# EAGLE design V2 (EAGLE 9.6.2)
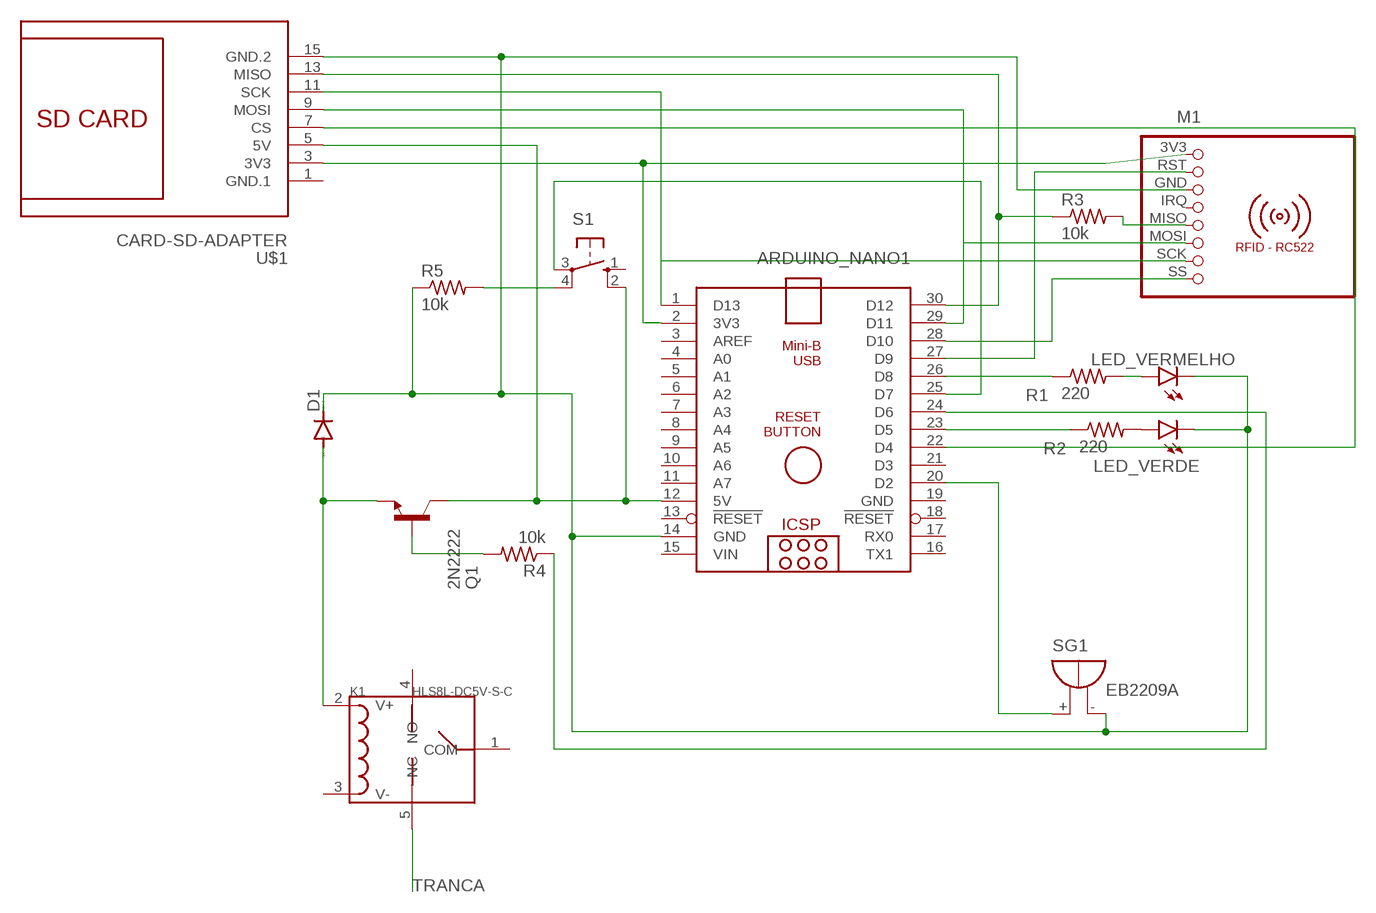
[diagram p0: schematic, sheet 1]

## Parts
ARDUINO_NANO1  ARDUINO_NANO  [ARDUINO_NANO]
D1  1N4148DO35-10  [DO35-10]
K1  HLS8L-DC5V-S-C  RELAY-HLS8L-DC5V-S-C(5P-19X15MM)  [REY5-19.0X15.0X15.0MM]
LED_VERDE  -LED  [LED5]
LED_VERMELHO  -LED  [LED5]
M1  RFID-RC522  [RFID-RC522]
Q1  2N2222  [TO92-CBE]
R1  220  R-US_0204/5  [0204/5]
R2  220  R-US_0204/5  [0204/5]
R3  10k  R-US_0204/5  [0204/5]
R4  10k  R-US_0204/5  [0204/5]
R5  10k  R-US_0204/5  [0204/5]
S1  10-XX  [B3F-10XX]
SG1  EB2209A  [EB2209A]
U$1  CARD-SD-ADAPTER  [CARD-SD-ADAPTER]

## Nets
N$1: ARDUINO_NANO1.20(D2) SG1.+
N$2: LED_VERMELHO.ANODE R1.2
N$3: LED_VERDE.ANODE R2.2
N$4: ARDUINO_NANO1.26(D8) R1.1
N$5: ARDUINO_NANO1.23(D5) R2.1
N$6: ARDUINO_NANO1.24(D6) R4.1
N$7: D1.A K1.2(V+) Q1.E
N$8: Q1.B R4.2
N$9: ARDUINO_NANO1.14(GND) D1.C LED_VERDE.CATHODE LED_VERMELHO.CATHODE M1.GND R5.1 SG1.- U$1.15(GND.2)
N$10: ARDUINO_NANO1.12(5V) Q1.C S1.2(S1) U$1.5(5V)
N$11: ARDUINO_NANO1.25(D7) S1.3(P)
N$12: ARDUINO_NANO1.2(3V3) M1.3V3 U$1.3(3V3)
N$13: R5.2 S1.4(P1)
N$14: ARDUINO_NANO1.27(D9) M1.RST
N$15: M1.MISO R3.2
N$16: ARDUINO_NANO1.30(D12) R3.1 U$1.13(MISO)
N$17: ARDUINO_NANO1.29(D11) M1.MOSI U$1.9(MOSI)
N$18: ARDUINO_NANO1.22(D4) U$1.7(CS)
N$19: ARDUINO_NANO1.28(D10) M1.SS
N$20: ARDUINO_NANO1.1(D13) M1.SCK U$1.11(SCK)
TRANCA: K1.5(NC)
Unconnected: ARDUINO_NANO1.3(AREF) ARDUINO_NANO1.4(A0) ARDUINO_NANO1.5(A1) ARDUINO_NANO1.6(A2) ARDUINO_NANO1.7(A3) ARDUINO_NANO1.8(A4) ARDUINO_NANO1.9(A5) ARDUINO_NANO1.10(A6) ARDUINO_NANO1.11(A7) ARDUINO_NANO1.13(!RESET) ARDUINO_NANO1.16(TX1) ARDUINO_NANO1.17(RX0) ARDUINO_NANO1.18(!RESET) ARDUINO_NANO1.21(D3) K1.1(COM) K1.3(V-) K1.4(NO) M1.IRQ S1.1(S)

## Power pins joined to a net without a drawn wire
GND: ARDUINO_NANO1.19(GND)
GND.1: U$1.1(GND.1)
VIN: ARDUINO_NANO1.15(VIN)

## Library data of the parts
ARDUINO_NANO1 = ArduinoNanoV30:ARDUINO_NANO: Arduino Nano V3.0 Overview: The Arduino Nano is a small, complete, and breadboard-friendly board based on the ATmega328 (Arduino Nano 3.x) or ATmega168 (Arduino Nano 2.x). It has more or less the same functionality of the Arduino Duemilanove, but in a different package. It lacks only a DC power jack, and works with a Mini-B USB cable instead of a standard one. The Nano was designed and is being produced by Gravitech. Specifications: Microcontroller Atmel ATmega168 or ATmega328 Operating Voltage (logic level) 5 V Input Voltage (recommended) 7-12 V Input Voltage (limits) 6-20 V Digital I/O Pins 14 (of which 6 provide PWM output) Analog Input Pins 8 DC Current per I/O Pin 40 mA Flash Memory 16 KB (ATmega168) or 32 KB (ATmega328) of which 2 KB used by bootloader SRAM 1 KB (ATmega168) or 2 KB (ATmega328) EEPROM 512 bytes (ATmega168) or 1 KB (ATmega328) Clock Speed 16 MHz Dimensions 0.73" x 1.70" Length 45 mm Width 18 mm Weigth 5 g Power: The Arduino Nano can be powered via the Mini-B USB connection, 6-20V unregulated external power supply (pin 30), or 5V regulated external power supply (pin 27). The power source is automatically selected to the highest voltage source. Memory: The ATmega168 has 16 KB of flash memory for storing code (of which 2 KB is used for the bootloader); the ATmega328 has 32 KB, (also with 2 KB used for the bootloader). The ATmega168 has 1 KB of SRAM and 512 bytes of EEPROM (which can be read and written with the EEPROM library); the ATmega328 has 2 KB of SRAM and 1 KB of EEPROM. Input and Output: Each of the 14 digital pins on the Nano can be used as an input or output, using pinMode(), digitalWrite(), and digitalRead() functions. They operate at 5 volts. Each pin can provide or receive a maximum of 40 mA and has an internal pull-up resistor (disconnected by default) of 20-50 kOhms. In addition, some pins have specialized functions. Visit Arduino - ArduinoBoardNano <https://www.arduino.cc/en/Main/ArduinoBoardNano>
D1 = diode:1N4148: DIODE high speed (Philips)
K1 = nosso_relay:RELAY-HLS8L-DC5V-S-C(5P-19X15MM): 315030000; MPN: HLS8L-DC5V-S-C
LED_VERDE LED_VERMELHO = LED_library:-LED
M1 = MFRC522:RFID-RC522: RFID-RC522 MFRC-522 based breakout board
Q1 = RFID Reader Part Library:2N2222*: NPN Transistor
R1-R5 = rcl:R-US_: RESISTOR, American symbol; SPICEPREFIX: R
S1 = switch-omron:10-XX: OMRON SWITCH; MPN: B3F-1000; OC_FARNELL: 176432; OC_NEWARK: 36M3542
SG1 = buzzer:EB2209A: BUZZER Source: Buerklin; OC_FARNELL: unknown; OC_NEWARK: unknown
U$1 = diy-modules:CARD-SD-ADAPTER: Full Size SD Card Adapter Module with onboard 3.3V regulator Guide describing how to use SD card with Arduino is available here: https://www.arduino.cc/en/Reference/SDCardNotes Click here to find device on ebay.com <http://www.ebay.com/sch/sd+card+socket+module>

## Net classes
0 default: width 0.508 mm
1 Alimentacao: width 1.016 mm

## Board
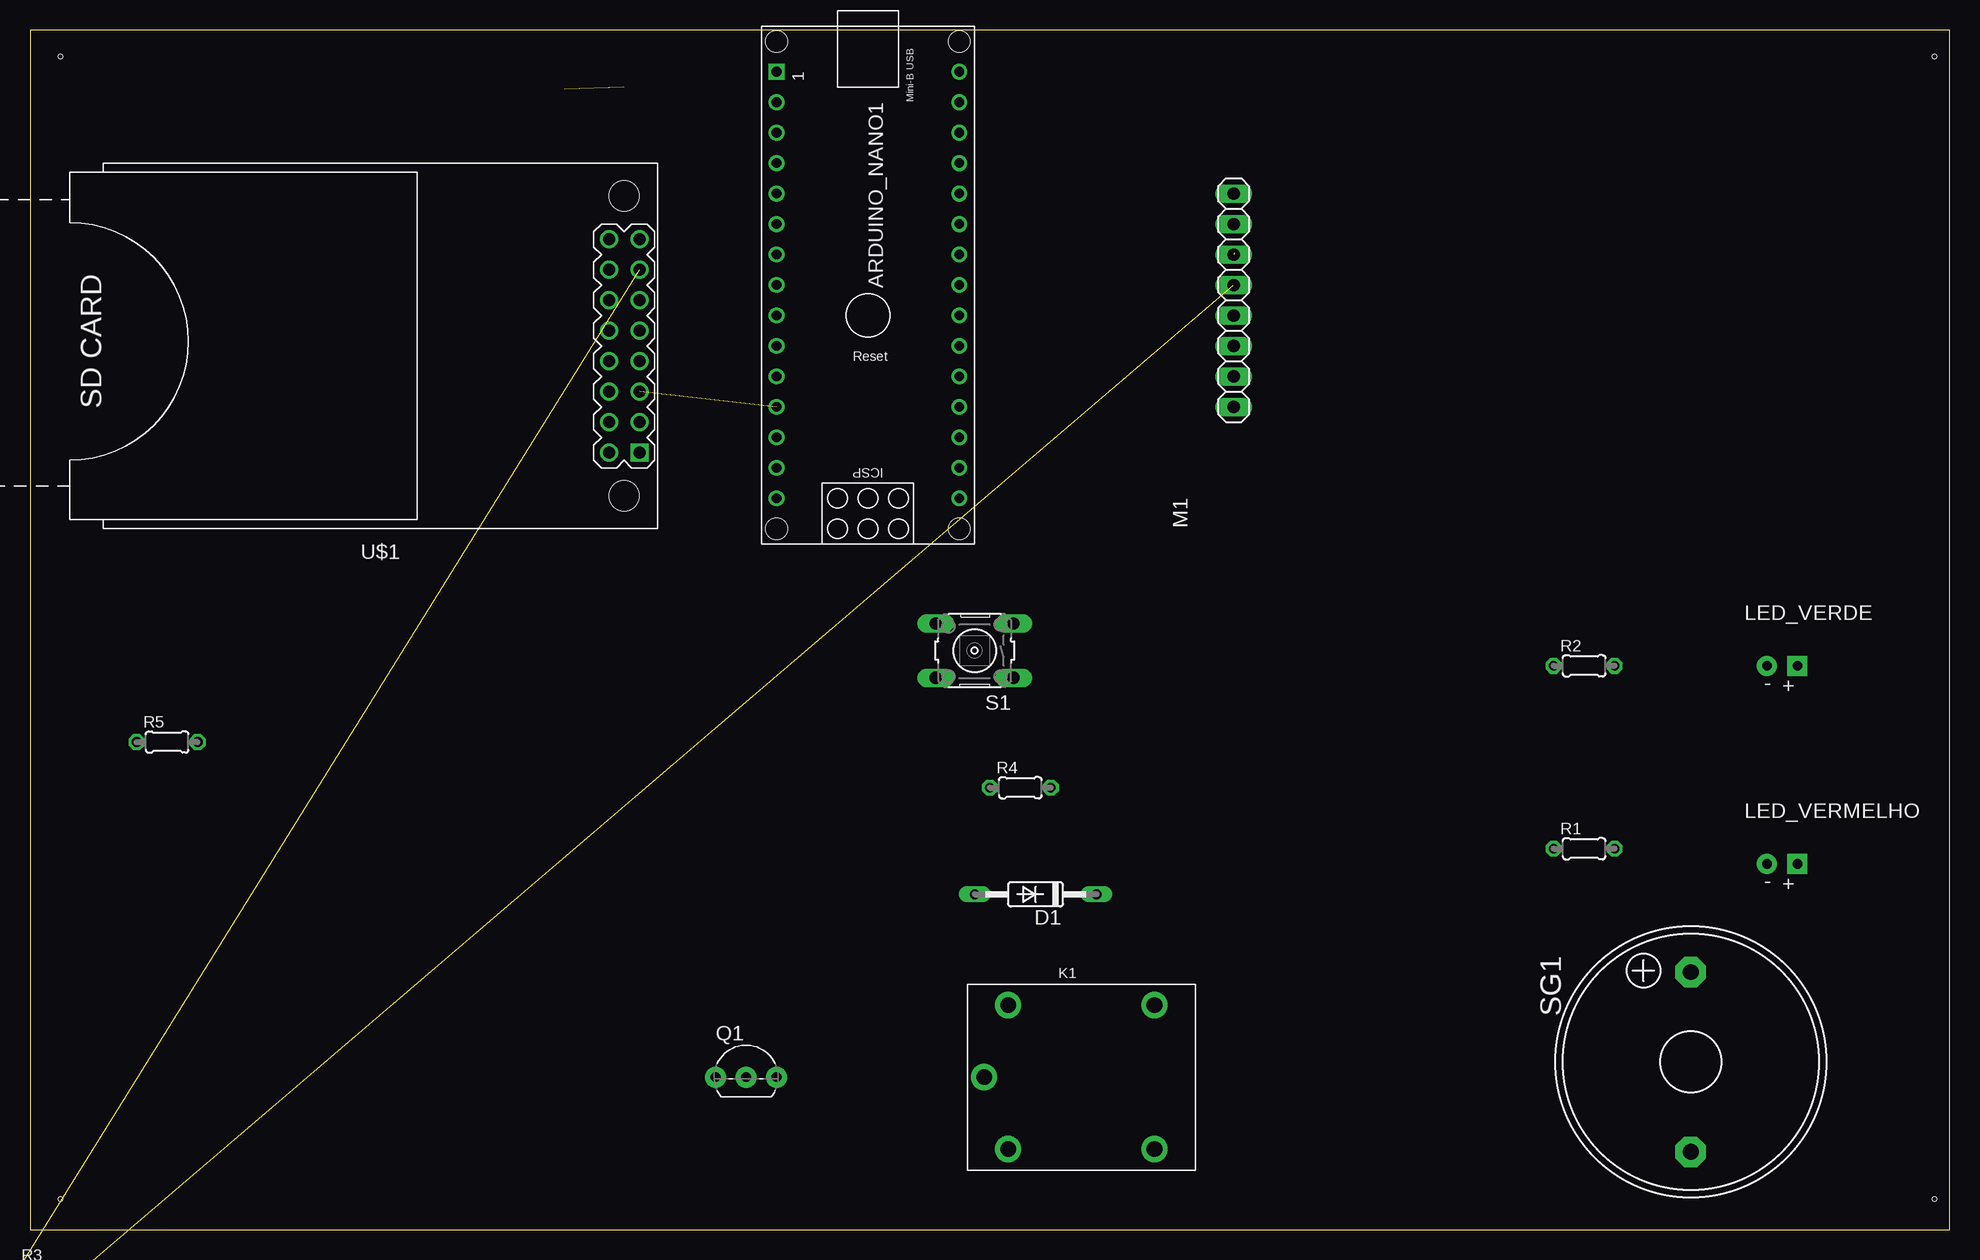
[diagram p1: board, top side]
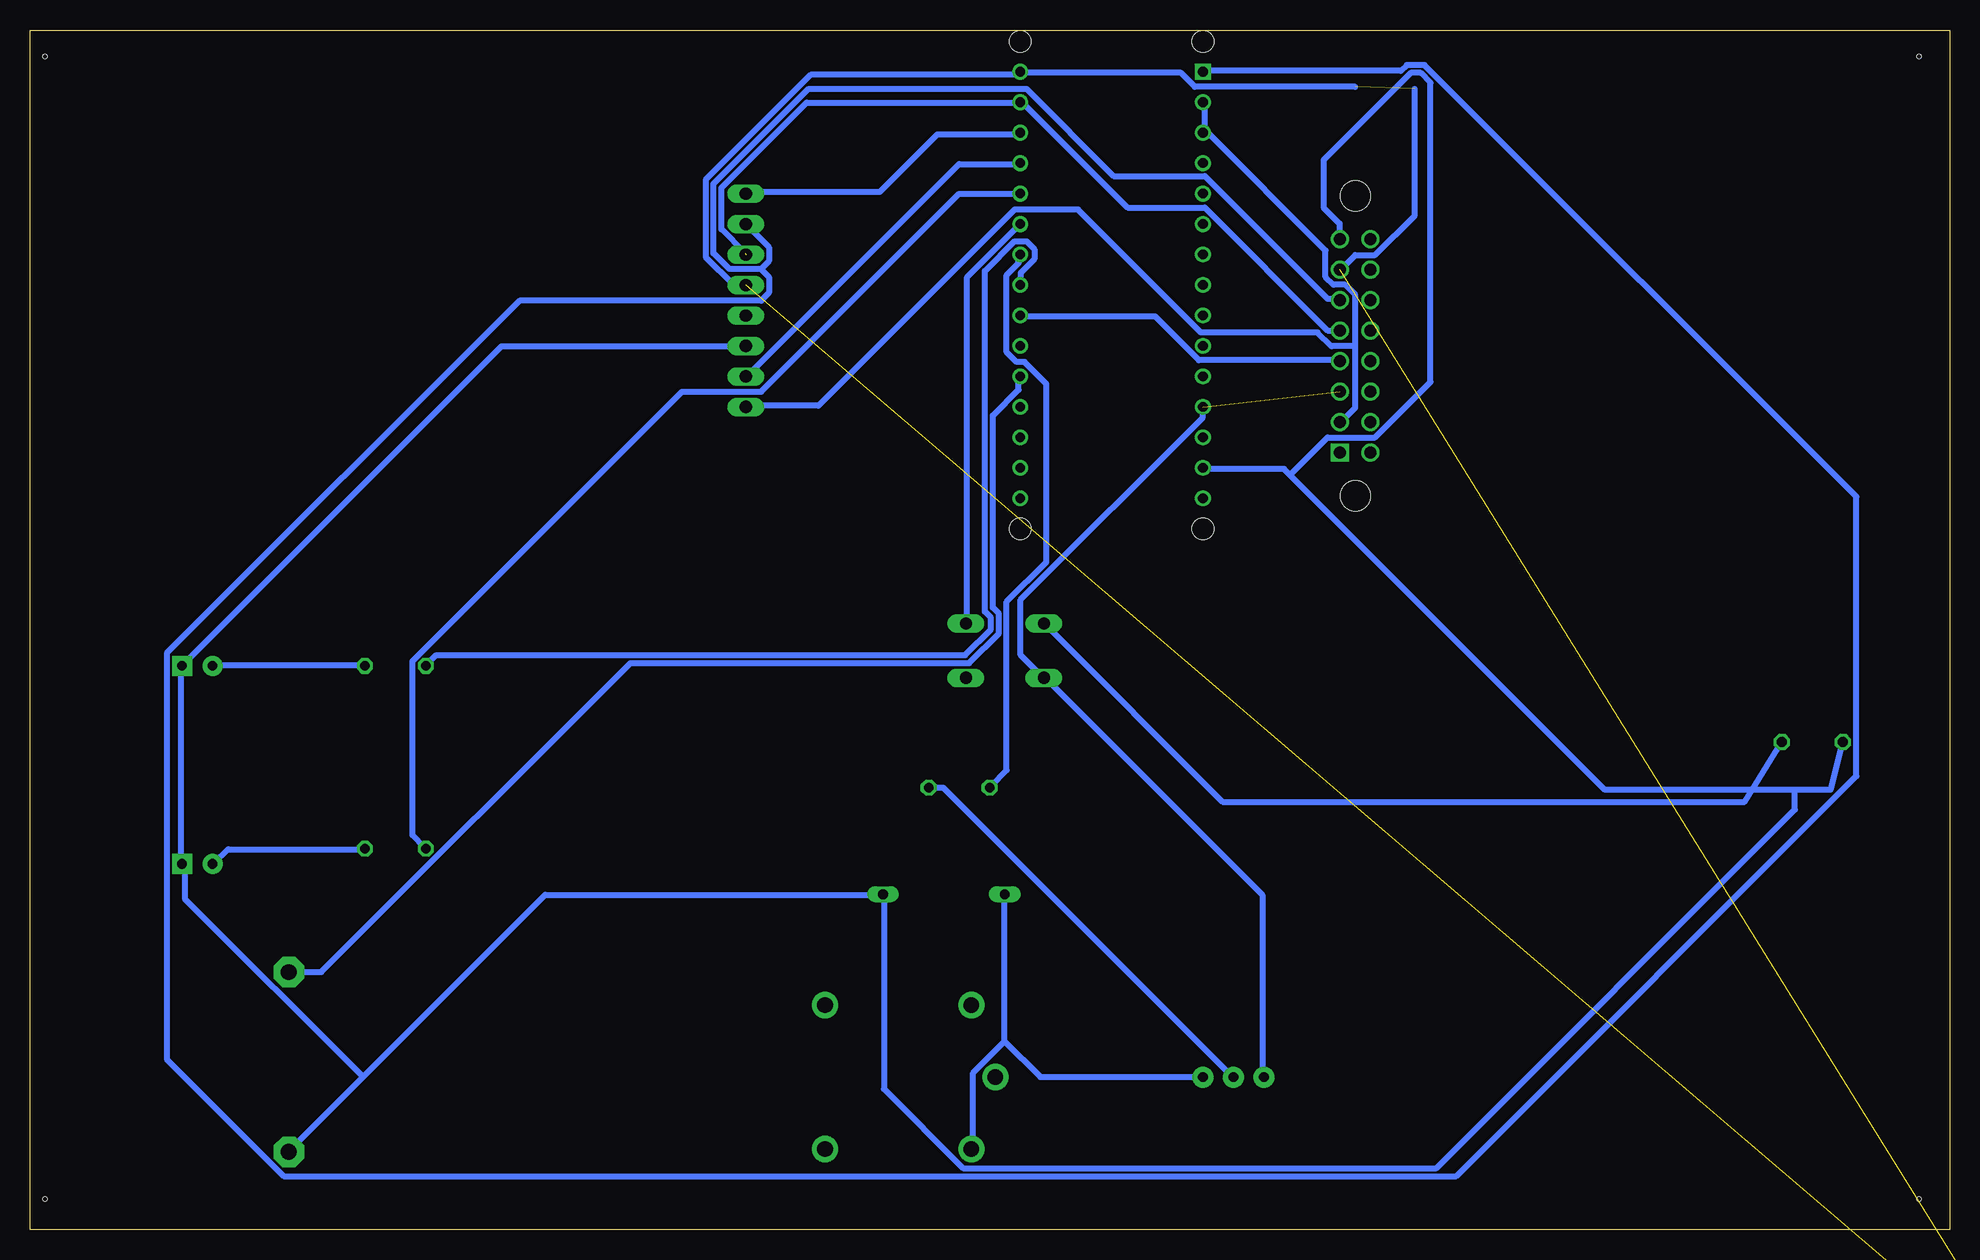
[diagram p2: board, bottom side, seen from below]

Size 160 x 100 mm. Coordinates in mm from the lower left corner, seen from the top.
Outline: 0,0 160,0 160,100 0,100 0,0
Copper layers (1*16): Top 0.035mm / dielectric 1.5mm / Bottom 0.035mm
Design rules "default": minimum track width 6mil, minimum drill 0.35mm, track to track 6mil, track to pad 6mil, pad to pad 6mil, via to via 6mil, smd to smd 6mil, copper to edge 40mil, drill to drill 6mil, minimum pad ring 10mil, minimum via ring 8mil, stop-mask expansion 4mil, vias tented up to drill 0mil, thermal gap 10mil
Holes 0.35 mm at 2.54,97.79 2.54,2.54 158.75,97.79 158.75,2.54

### Footprints (pad centres in the part's own frame; a part is rotated, then mirrored left to right if it is on the bottom)
ARDUINO_NANO = drill 0.8 square: 1 -20.32,-7.62 | drill 0.8: 2 -17.78,-7.62; 3 -15.24,-7.62; 4 -12.7,-7.62; 5 -10.16,-7.62; 6 -7.62,-7.62; 7 -5.08,-7.62; 8 -2.54,-7.62; 9 0,-7.62; 10 2.54,-7.62; 11 5.08,-7.62; 12 7.62,-7.62; 13 10.16,-7.62; 14 12.7,-7.62; 15 15.24,-7.62; 16 15.24,7.62; 17 12.7,7.62; 18 10.16,7.62; 19 7.62,7.62; 20 5.08,7.62; 21 2.54,7.62; 22 0,7.62; 23 -2.54,7.62; 24 -5.08,7.62; 25 -7.62,7.62; 26 -10.16,7.62; 27 -12.7,7.62; 28 -15.24,7.62; 29 -17.78,7.62; 30 -20.32,7.62 | hole 1.778: -22.86,-7.62; -22.86,7.62; 17.78,7.62; 17.78,-7.62
DO35-10 = drill 0.813 long: A 5.08,0; C -5.08,0
REY5-19.0X15.0X15.0MM = drill 1.3 pad 2.184: 1 -8.1,0; 2 -6.1,-6; 3 -6.1,6; 4 6.1,-6; 5 6.1,6
LED5 = drill 0.8 pad 1.676: ANODE -1.27,0 | drill 0.8 pad 1.676 square: CATHODE 1.27,0
RFID-RC522 = drill 1.016 long: 3V3 -8.89,0; GND -3.81,0; IRQ -1.27,0; MISO 1.27,0; MOSI 3.81,0; RST -6.35,0; SCK 6.35,0; SS 8.89,0
TO92-CBE = drill 0.813 pad 1.75: B 0,0; C -2.54,0; E 2.54,0
0204/5 = drill 0.813 octagon: 1 -2.54,0; 2 2.54,0
B3F-10XX = drill 1.016 long: 1 -3.251,2.261; 2 3.251,2.261; 3 -3.251,-2.261; 4 3.251,-2.261
EB2209A = drill 1.321 pad 2.54 octagon: + 7.493,0; - -7.493,0
CARD-SD-ADAPTER = drill 1 square: 1 -21.59,8.89 | drill 1: 2 -19.05,8.89; 3 -21.59,6.35; 4 -19.05,6.35; 5 -21.59,3.81; 6 -19.05,3.81; 7 -21.59,1.27; 8 -19.05,1.27; 9 -21.59,-1.27; 10 -19.05,-1.27; 11 -21.59,-3.81; 12 -19.05,-3.81; 13 -21.59,-6.35; 14 -19.05,-6.35; 15 -21.59,-8.89; 16 -19.05,-8.89 | hole 2.5: -20.32,12.5; -20.32,-12.5

### Placement (x,y rotation side)
ARDUINO_NANO1  69.85,76.2 270 top
D1  83.82,27.94 180 top
K1  87.63,12.7 0 top
LED_VERDE  146.05,46.99 0 top
LED_VERMELHO  146.05,30.48 0 top
M1  100.33,77.47 90 top
Q1  59.69,12.7 0 top
R1  129.54,31.75 0 top
R2  129.54,46.99 0 top
R3  1.27,-3.81 0 top  (outside the outline)
R4  82.55,36.83 0 top
R5  11.43,40.64 0 top
S1  78.74,48.26 180 top
SG1  138.43,13.97 90 top
U$1  29.21,73.66 180 top

### Tracks (layer width: path | path; a pad name or v marks a point on that pad's centre or on a via)
GND
  pour Bottom (isolate 1.27): 2.54,97.79 2.54,2.54 158.75,2.54 158.75,97.79
N$1
  Bottom 0.508: SG1.+ 135.71,21.46 109.96,47.22 81.72,47.22 79.25,49.7 79.25,51.35 79.74,51.84 79.74,67.86 77.6,70 77.6,70.99 ARDUINO_NANO1.20
N$2
  Bottom 0.508: R1.2 132.08,31.7 143.47,31.7 144.63,30.54 LED_VERMELHO.ANODE
N$3
  Bottom 0.508: R2.2 132.08,47.05 144.63,47.05 LED_VERDE.ANODE
N$4
  Bottom 0.508: ARDUINO_NANO1.26 77.6,86.35 82.55,86.35 99.06,69.84 105.66,69.84 128.12,47.38 128.12,32.85 127.13,31.86 R1.1
N$5
  Bottom 0.508: ARDUINO_NANO1.23 77.43,78.75 77.43,79.74 76.28,80.9 76.28,81.72 76.94,82.39 77.93,82.39 80.4,79.91 80.4,51.51 79.91,51.02 79.91,50.02 82.06,47.88 126.14,47.88 126.96,47.05 R2.1
N$6
  Bottom 0.508: ARDUINO_NANO1.24 77.6,81.23 77.6,80.57 78.59,79.58 78.59,73.14 77.76,72.31 77.1,72.31 75.29,70.5 75.29,55.64 78.59,52.34 78.59,38.3 79.91,36.98 R4.1
N$7
  Bottom 0.508: 78.75,15.68 78.75,27.9 D1.A | 78.75,15.68 81.39,13.04 81.39,6.77 K1.2 | 78.75,15.68 75.78,12.71 62.24,12.71 Q1.E
N$8
  Bottom 0.508: R4.2 85.03,36.82 83.87,36.82 59.77,12.71 Q1.B
N$9
  Bottom 0.508: 54.98,62.9 28.73,36.65 12.88,36.65 | 54.98,62.9 55.47,63.4 62.08,63.4 ARDUINO_NANO1.14 | 12.88,36.65 9.91,36.65 8.91,40.62 R5.1 | 54.98,62.9 51.84,66.04 47.88,66.04 43.26,70.66 43.26,95.59 44.08,96.42 44.91,96.42 52.17,89.15 52.17,85.19 50.85,83.87 50.85,82.55 U$1.15 | 132.25,12.71 138.35,6.6 SG1.- | 132.25,12.71 117.06,27.9 88.99,27.9 D1.C 88.82,27.74 88.82,11.72 82.22,5.12 42.76,5.12 12.88,35 12.88,36.65 | M1.GND 100.38,73.64 120.69,73.64 147.27,47.05 LED_VERDE.CATHODE 147.43,46.89 147.43,30.54 LED_VERMELHO.CATHODE 147.1,30.38 147.1,27.57 132.25,12.71
N$10  (1 unrouted)
  Bottom 0.508: ARDUINO_NANO1.12 62.24,68.52 62.24,67.69 77.43,52.5 77.43,47.88 75.62,46.06 S1.2 75.29,45.9 57.29,27.9 57.29,12.71 Q1.C
N$11
  Bottom 0.508: ARDUINO_NANO1.25 77.6,83.71 81.89,79.41 81.89,50.52 S1.3
N$12
  Bottom 0.508: 49.53,73.64 49.53,68.52 50.69,67.36 U$1.3 | 49.53,73.64 49.53,77.93 50.35,78.75 51.35,78.75 52.01,79.41 52.01,81.61 62.08,91.68 62.08,93.94 ARDUINO_NANO1.2 | 49.53,73.64 51.51,73.64 52.67,74.79 62.41,74.79 72.64,85.03 77.93,85.03 94.27,68.68 100.22,68.68 M1.3V3
N$13
  Bottom 0.508: R5.2 17.08,35.66 60.59,35.66 75.45,50.52 S1.4
N$14
  Bottom 0.508: ARDUINO_NANO1.27 77.6,88.82 82.55,88.82 100.22,71.16 M1.RST
N$15  (1 unrouted)
N$16  (2 unrouted)
  Bottom 0.508: 49.53,95.26 62.9,95.26 64.06,96.42 77.43,96.42 ARDUINO_NANO1.30 77.6,96.25 94.93,96.25 103.68,87.5 103.68,81.06 101.37,78.75 100.38,78.75 | 44.58,95.1 44.58,84.53 47.88,81.23 49.53,81.23 50.69,80.07 U$1.13
N$17  (1 unrouted)
  Bottom 0.508: 100.38,81.39 102.36,83.38 102.36,86.84 95.26,93.94 77.6,93.94 ARDUINO_NANO1.29 77.27,93.94 68.52,85.19 62.08,85.19 51.84,74.95 50.85,74.95 U$1.9
N$18
  Bottom 0.508: ARDUINO_NANO1.22 77.43,76.11 66.2,76.11 62.57,72.48 50.85,72.48 U$1.7
N$19
  Bottom 0.508: ARDUINO_NANO1.28 77.6,91.3 84.37,91.3 89.15,86.51 100.22,86.51 M1.SS
N$20
  Bottom 0.508: 99.06,80.07 101.7,80.07 103.02,81.39 103.02,87.17 95.1,95.1 76.94,95.1 69.67,87.83 62.08,87.83 51.84,77.6 50.85,77.6 U$1.11 | 99.06,80.07 98.4,80.73 98.4,81.89 M1.SCK | 99.06,80.07 98.4,79.41 98.4,78.09 99.06,77.43 119.2,77.43 148.59,48.04 148.59,14.2 138.85,4.46 41.11,4.46 7.76,37.81 7.76,61.09 43.75,97.08 45.24,97.08 45.73,96.58 62.08,96.58 ARDUINO_NANO1.1